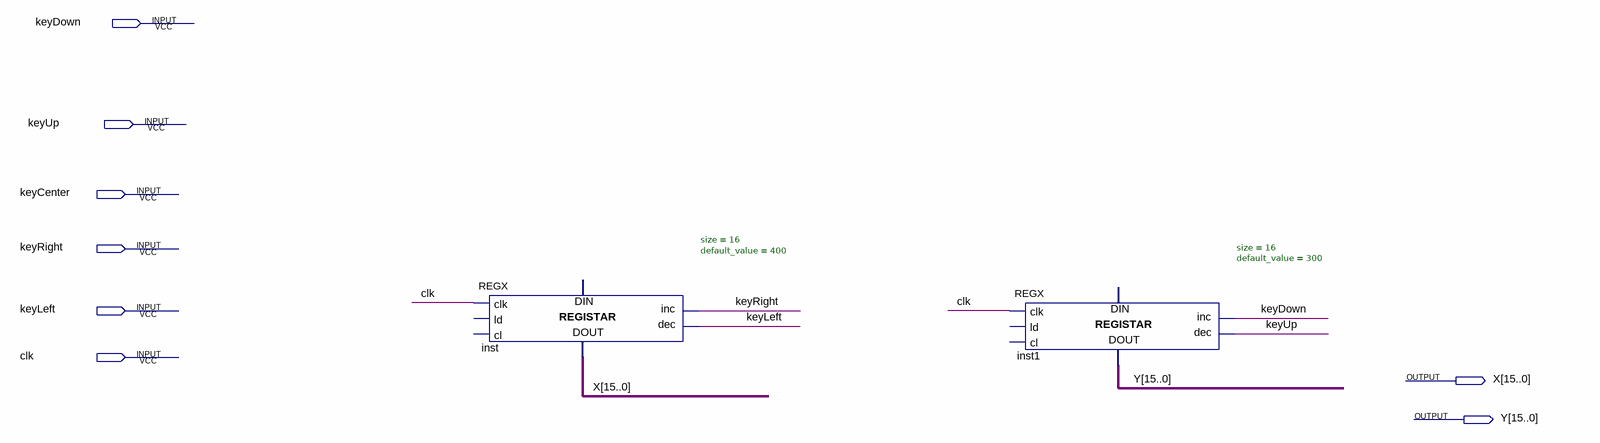
[diagram p0: schematic sheet]
// Quartus schematic targetReg.bdf as structural Verilog: 2 symbols, 8 pins
module targetReg (
  input  keyDown,
  input  keyUp,
  input  keyCenter,
  input  keyRight,
  input  keyLeft,
  input  clk,
  output [15:0] X,
  output [15:0] Y
);

  REGX #(.size(16), .default_value(400)) inst (
    .clk(clk), .inc(keyRight), .dec(keyLeft), .data_out(X));  // open: ld, cl, data_in
  REGX #(.size(16), .default_value(300)) inst1 (
    .clk(clk), .inc(keyDown), .dec(keyUp), .data_out(Y));  // open: ld, cl, data_in
endmodule
